# EAGLE design interface-ext (EAGLE 9.5.2)
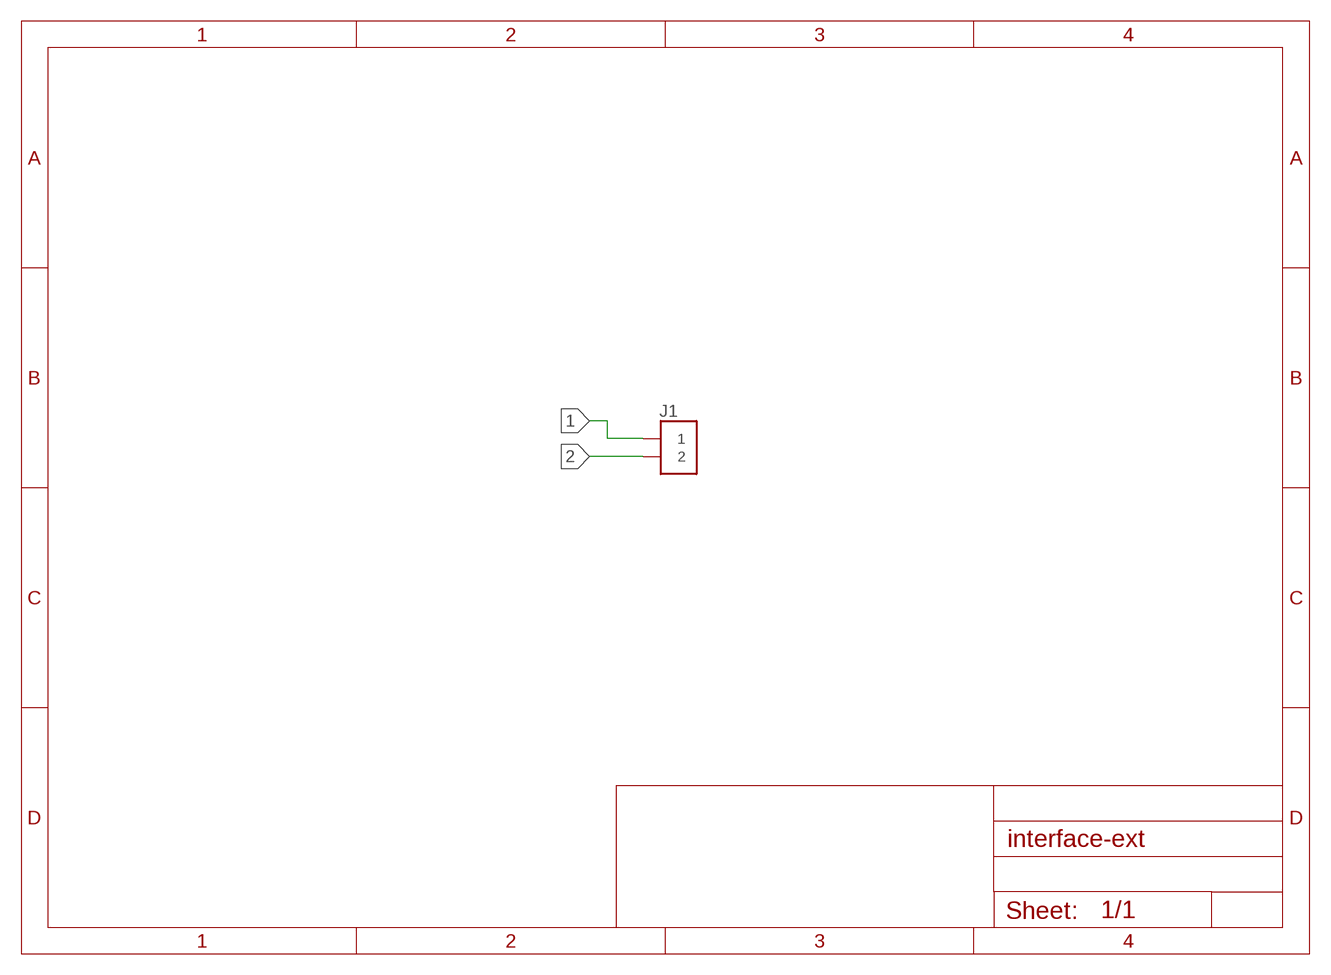
[diagram p0: schematic, sheet 1]

## Parts
J1  JST-02TOP  [BM02B-GHS]

## Nets
1: J1.1
2: J1.2

## Library data of the parts
J1 = con-jst-gh:JST-02

## Board
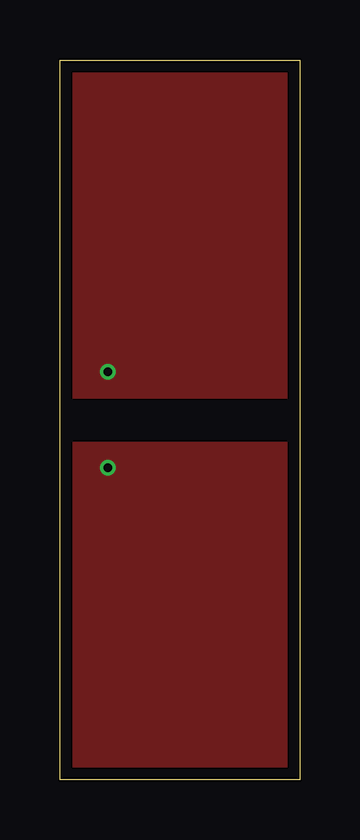
[diagram p1: board, top side]
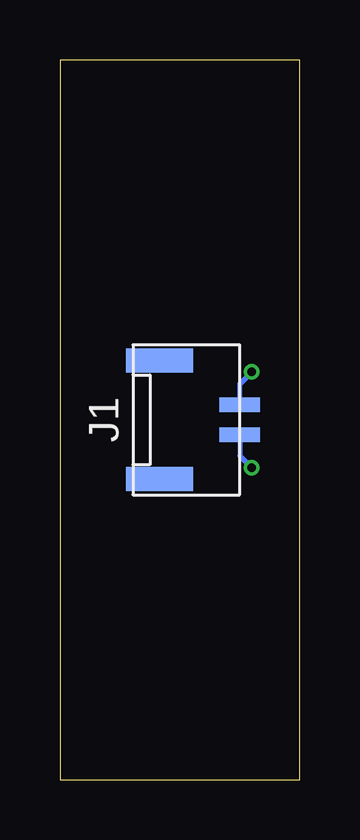
[diagram p2: board, bottom side, seen from below]

Size 10 x 30 mm. Coordinates in mm from the lower left corner, seen from the top.
Outline: 0,0 0,30 10,30 10,0 0,0
Copper layers (1*16): Top 0.035mm / dielectric 1.6mm / Bottom 0.035mm
Design rules "Elecrow_2-layer_PCB_eagle_rule": minimum track width 6mil, minimum drill 12mil, track to track 6mil, track to pad 6mil, pad to pad 6mil, via to via 8mil, smd to smd 0mil, copper to edge 20mil, drill to drill 10mil, minimum pad ring 6mil, minimum via ring 6mil, stop-mask expansion 0mil, vias tented up to drill 100mil, thermal gap 10mil
bKeepout: 4 lines

### Footprints (pad centres in the part's own frame; a part is rotated, then mirrored left to right if it is on the bottom)
BM02B-GHS = smd 0.6 x 1.7: 1 0.625,2.5; 2 -0.625,2.5 | smd 1 x 2.8: CASE0 2.475,-0.85; CASE1 -2.475,-0.85

### Placement (x,y rotation side)
J1  5,15 270 bottom

### Tracks (layer width: path | path; a pad name or v marks a point on that pad's centre or on a via)
1  (via drill 0.35)
  Bottom 0.2: J1.1 2.5,13.5 v2,13
  pour Top (no thermals): 0,0 0,14 10,14 10,0
2  (via drill 0.35)
  Bottom 0.2: J1.2 2.5,16.5 v2,17
  pour Top (no thermals): 0,30 0,16 10,16 10,30